# EAGLE schematic Scheda motori a4988 (EAGLE 9.5.2)
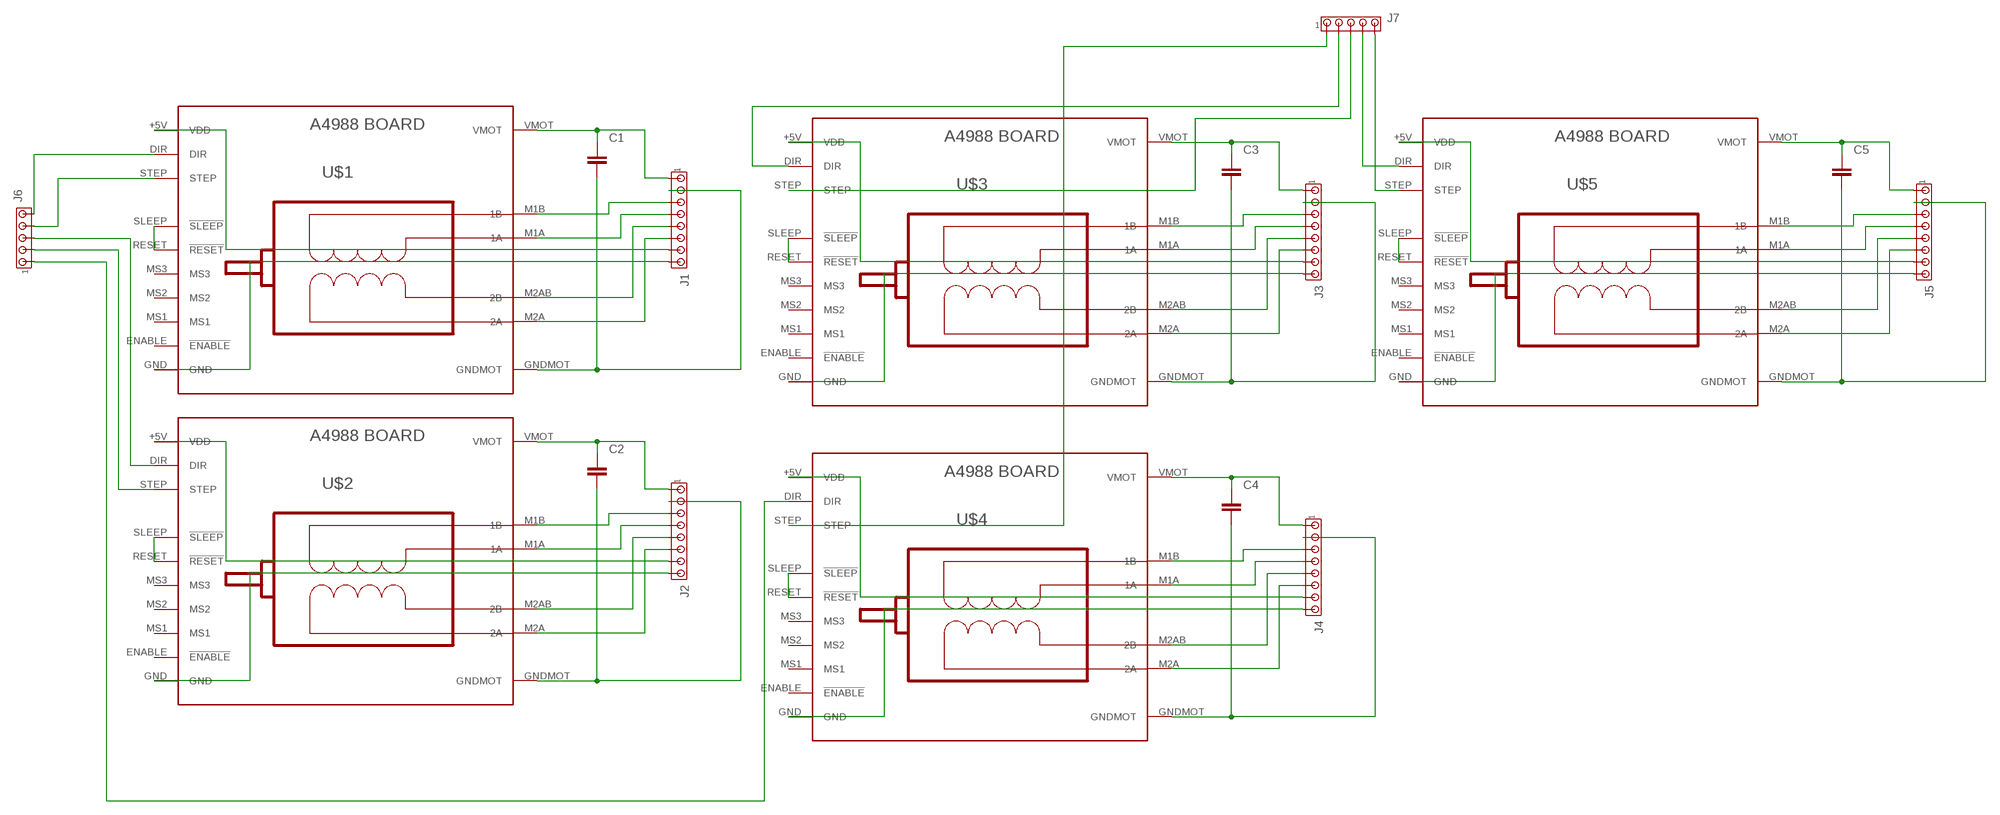
[diagram p0: schematic, sheet 1]

## Parts
C1  C_RADIAL-12.5MM-DIA  [CAPRD550W60D1025H1250B]
C2  C_RADIAL-12.5MM-DIA  [CAPRD550W60D1025H1250B]
C3  C_RADIAL-12.5MM-DIA  [CAPRD550W60D1025H1250B]
C4  C_RADIAL-12.5MM-DIA  [CAPRD550W60D1025H1250B]
C5  C_RADIAL-12.5MM-DIA  [CAPRD550W60D1025H1250B]
J1  MTA08-100  [10X08MTA]
J2  MTA08-100  [10X08MTA]
J3  MTA08-100  [10X08MTA]
J4  MTA08-100  [10X08MTA]
J5  MTA08-100  [10X08MTA]
J6  MTA05-156  [1X5MTA]
J7  MTA05-156  [1X5MTA]
U$1  BOARD_A4988  [BOARD_A4988]
U$2  BOARD_A4988  [BOARD_A4988]
U$3  BOARD_A4988  [BOARD_A4988]
U$4  BOARD_A4988  [BOARD_A4988]
U$5  BOARD_A4988  [BOARD_A4988]

## Nets
N$1: U$1.RESET(!RESET) U$1.SLEEP(!SLEEP)
N$2: C1.2 J1.2 U$1.GNDMOT
N$3: C1.1 J1.1 U$1.VMOT
N$4: U$2.RESET(!RESET) U$2.SLEEP(!SLEEP)
N$5: J1.3 U$1.M1B(1B)
N$6: J1.4 U$1.M1A(1A)
N$7: J1.5 U$1.M2AB(2B)
N$8: J1.6 U$1.M2A(2A)
N$9: J1.7 U$1.+5V(VDD)
N$10: J1.8 U$1.GND
N$11: C2.2 J2.2 U$2.GNDMOT
N$12: C2.1 J2.1 U$2.VMOT
N$13: J2.3 U$2.M1B(1B)
N$14: J2.4 U$2.M1A(1A)
N$15: J2.5 U$2.M2AB(2B)
N$16: J2.6 U$2.M2A(2A)
N$17: J2.7 U$2.+5V(VDD)
N$18: J2.8 U$2.GND
N$19: U$3.RESET(!RESET) U$3.SLEEP(!SLEEP)
N$20: C3.2 J3.2 U$3.GNDMOT
N$21: C3.1 J3.1 U$3.VMOT
N$22: J3.3 U$3.M1B(1B)
N$23: J3.4 U$3.M1A(1A)
N$24: J3.5 U$3.M2AB(2B)
N$25: J3.6 U$3.M2A(2A)
N$26: J3.7 U$3.+5V(VDD)
N$27: J3.8 U$3.GND
N$28: U$4.RESET(!RESET) U$4.SLEEP(!SLEEP)
N$29: C4.2 J4.2 U$4.GNDMOT
N$30: C4.1 J4.1 U$4.VMOT
N$31: J4.3 U$4.M1B(1B)
N$32: J4.4 U$4.M1A(1A)
N$33: J4.5 U$4.M2AB(2B)
N$34: J4.6 U$4.M2A(2A)
N$35: J4.7 U$4.+5V(VDD)
N$36: J4.8 U$4.GND
N$37: U$5.RESET(!RESET) U$5.SLEEP(!SLEEP)
N$38: C5.2 J5.2 U$5.GNDMOT
N$39: C5.1 J5.1 U$5.VMOT
N$40: J5.3 U$5.M1B(1B)
N$41: J5.4 U$5.M1A(1A)
N$42: J5.5 U$5.M2AB(2B)
N$43: J5.6 U$5.M2A(2A)
N$44: J5.7 U$5.+5V(VDD)
N$45: J5.8 U$5.GND
N$46: J6.5 U$1.DIR
N$47: J6.4 U$1.STEP
N$48: J6.3 U$2.DIR
N$49: J6.2 U$2.STEP
N$50: J6.1 U$4.DIR
N$51: J7.1 U$4.STEP
N$52: J7.2 U$3.DIR
N$53: J7.3 U$3.STEP
N$54: J7.4 U$5.DIR
N$55: J7.5 U$5.STEP
Unconnected: U$1.ENABLE(!ENABLE) U$1.MS1 U$1.MS2 U$1.MS3 U$2.ENABLE(!ENABLE) U$2.MS1 U$2.MS2 U$2.MS3 U$3.ENABLE(!ENABLE) U$3.MS1 U$3.MS2 U$3.MS3 U$4.ENABLE(!ENABLE) U$4.MS1 U$4.MS2 U$4.MS3 U$5.ENABLE(!ENABLE) U$5.MS1 U$5.MS2 U$5.MS3

## Library data of the parts
C1-C5 = Capacitor:C: Capacitor - Generic; CATEGORY: Capacitor
J1-J5 = con-amp:MTA08-100: AMP connector
J6 J7 = con-amp:MTA05-156: AMP connector
U$1-U$5 = Clean-Kong:BOARD_A4988